# Altium schematic sheet Sheet1.SchDoc
size A4; Organization: Altium Limited; Address1: L3, 12a Rodborough Rd; Address2: Frenchs Forest; Address3: NSW; Address4: Australia 2086
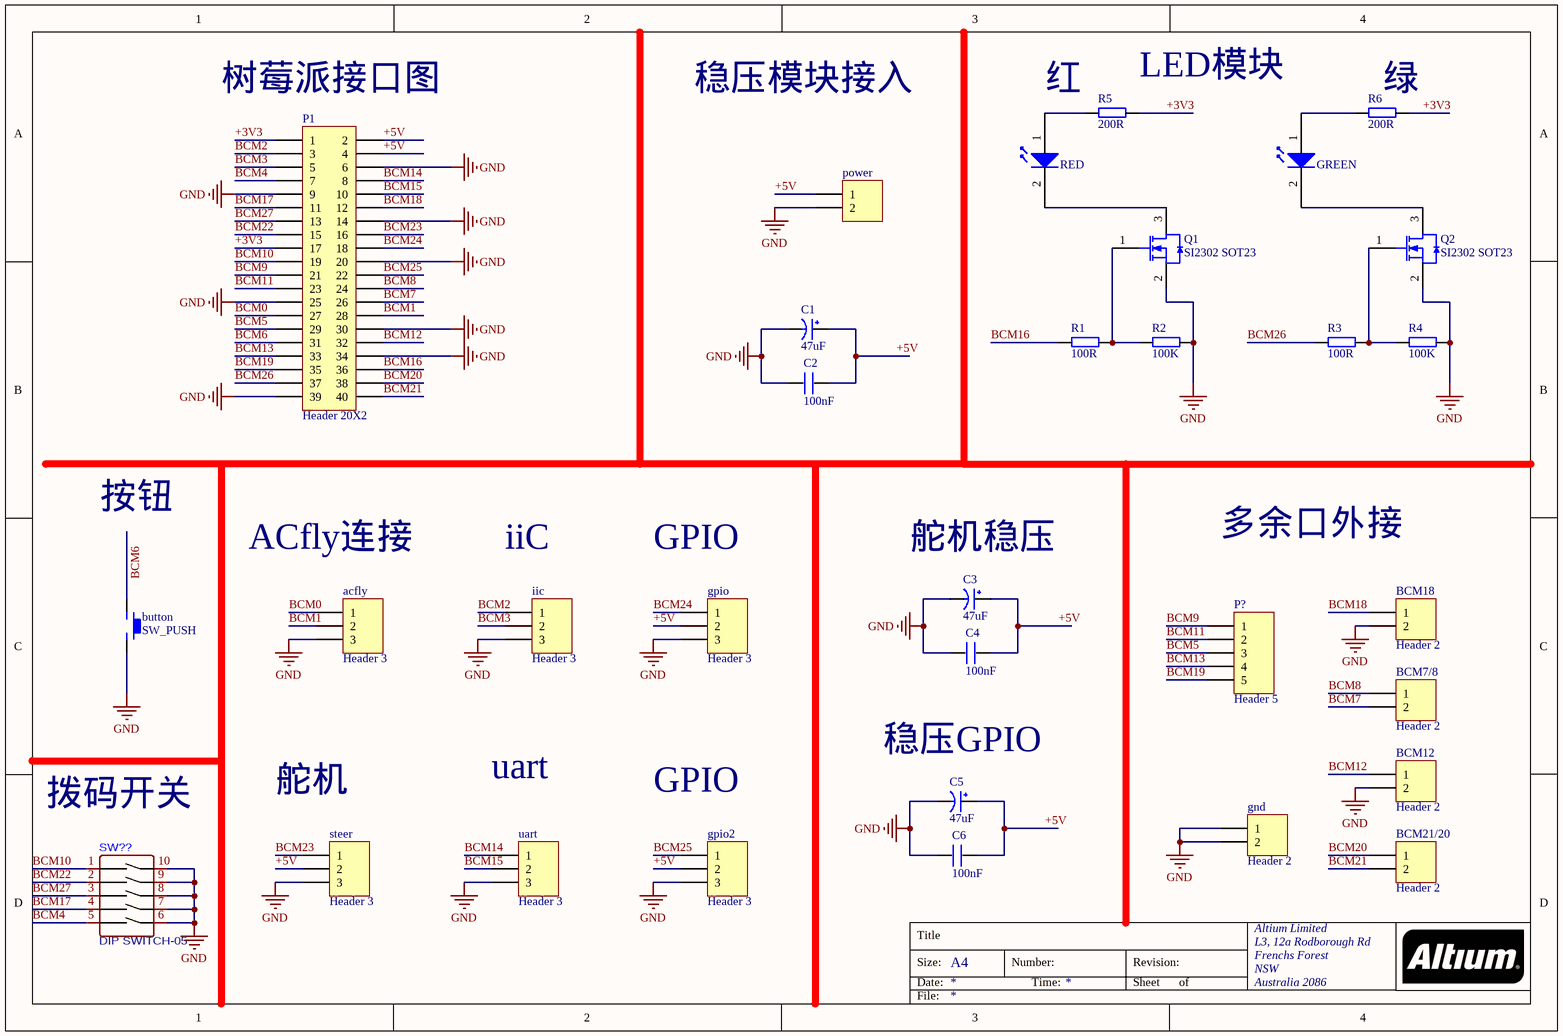
[diagram p0: Sheet1.SchDoc]

## Parts
acfly  Header 3  [GH1.25-LS-3P]
BCM7/8  Header 2  [HDR1X2]
BCM12  Header 2  [HDR1X2]
BCM18  Header 2  [HDR1X2]
BCM21/20  Header 2  [HDR1X2]
button  SW_PUSH  [KEY_3x6]
C1  47uF  [3216]
C2  100nF  [0603P]
C3  47uF  [3216]
C4  100nF  [0603P]
C5  47uF  [3216]
C6  100nF  [0603P]
gnd  Header 2  [HDR1X2]
gpio  Header 3  [GH1.25-LS-3P]
gpio2  Header 3  [GH1.25-LS-3P]
GREEN  LED?  [LED 5MM-G]  (value not drawn)
iic  Header 3  [GH1.25-LS-3P]
P1  Header 20X2  [HDR2X20]
P?  Header 5  [HDR1X5]
power  Battery  [HDR1X2]  (value not drawn)
Q1  SI2302 SOT23  [SOT-23]
Q2  SI2302 SOT23  [SOT-23]
R1  100R  [0603P]
R2  100K  [0603P]
R3  100R  [0603P]
R4  100K  [0603P]
R5  200R  [0603P]
R6  200R  [0603P]
RED  LED?  [LED 5MM-R]  (value not drawn)
steer  Header 3  [GH1.25-LS-3P]
SW??  DIP SWITCH-05  [DIP SWITCH-05]
uart  Header 3  [GH1.25-LS-3P]

## Nets
GND: acfly.3 BCM12.2 BCM18.2 button.2 C1.2(GND) C2.1 C3.2(GND) C4.1 C5.2(GND) C6.1 gnd.1 gnd.2 gpio.3 gpio2.3 iic.3 P1.6 P1.9 P1.14 P1.20 P1.25 P1.30 P1.34 P1.39 power.2 Q1.2(S) Q2.2(S) R2.1 R4.1 steer.3 SW??.6 SW??.7 SW??.8 SW??.9 SW??.10 uart.3
+3V3: P1.1 P1.17 R5.1 R6.1
+5V: C1.1(VCC) C2.2 C3.1(VCC) C4.2 C5.1(VCC) C6.2 gpio.2 gpio2.2 P1.2 P1.4 power.1 steer.2
BCM0: acfly.1 P1.27
BCM1: acfly.2 P1.28
BCM2: iic.1 P1.3
BCM3: iic.2 P1.5
BCM4: P1.7 SW??.5
BCM5: P1.29 P?.3
BCM6: button.1 P1.31
BCM7: BCM7/8.2 P1.26
BCM8: BCM7/8.1 P1.24
BCM9: P1.21 P?.1
BCM10: P1.19 SW??.1
BCM11: P1.23 P?.2
BCM12: BCM12.1 P1.32
BCM13: P1.33 P?.4
BCM14: P1.8 uart.1
BCM15: P1.10 uart.2
BCM16: P1.36 R1.2
BCM17: P1.11 SW??.4
BCM18: BCM18.1 P1.12
BCM19: P1.35 P?.5
BCM20: BCM21/20.1 P1.38
BCM21: BCM21/20.2 P1.40
BCM22: P1.15 SW??.2
BCM23: P1.16 steer.1
BCM24: gpio.1 P1.18
BCM25: gpio2.1 P1.22
BCM26: P1.37 R3.2
BCM27: P1.13 SW??.3
NetGREEN_1: GREEN.1 R6.2
NetGREEN_2: GREEN.2 Q2.3(D)
NetQ1_1: Q1.1(G) R1.1 R2.2
NetQ1_3: Q1.3(D) RED.2
NetQ2_1: Q2.1(G) R3.1 R4.2
NetR5_2: R5.2 RED.1

## Notes on the sheet
- (near P1) 树莓派接口图
- 稳压模块接入
- 红
- (near R5) LED模块
- (near R6) 绿
- 按钮
- ACfly连接
- iiC
- GPIO
- (near C3) 舵机稳压
- 多余口外接
- uart
- (near C5) 稳压GPIO
- 拨码开关
- 舵机
- Title
- Size:
- Date:
- A4
- Number:
- Time:
- Revision:
- Sheet
- of
- File:

## Library data of the parts
acfly gpio gpio2 iic steer uart = Header 3: Header, 3-Pin; LatestRevisionDate: 17-Jul-2002; LatestRevisionNote: Re-released for DXP Platform.; Publisher: Altium Limited
BCM7/8 BCM12 BCM18 BCM21/20 gnd power = Header 2: Header, 2-Pin; LatestRevisionDate: 17-Jul-2002; LatestRevisionNote: Re-released for DXP Platform.; Publisher: Altium Limited
button = KEY
C1 C3 C5 = CAP
C2 C4 C6 = C
GREEN RED = LED
P1 = Header 20X2: Header, 20-Pin, Dual row; LatestRevisionDate: 17-Jul-2002; LatestRevisionNote: Re-released for DXP Platform.; Publisher: Altium Limited
P? = Header 5: Header, 5-Pin; LatestRevisionDate: 17-Jul-2002; LatestRevisionNote: Re-released for DXP Platform.; Publisher: Altium Limited
Q1 Q2 = NMOS
R1-R6 = R